# Altium schematic sheet main_sch.SchDoc
size C; SheetNumber: 2; SheetTotal: 2
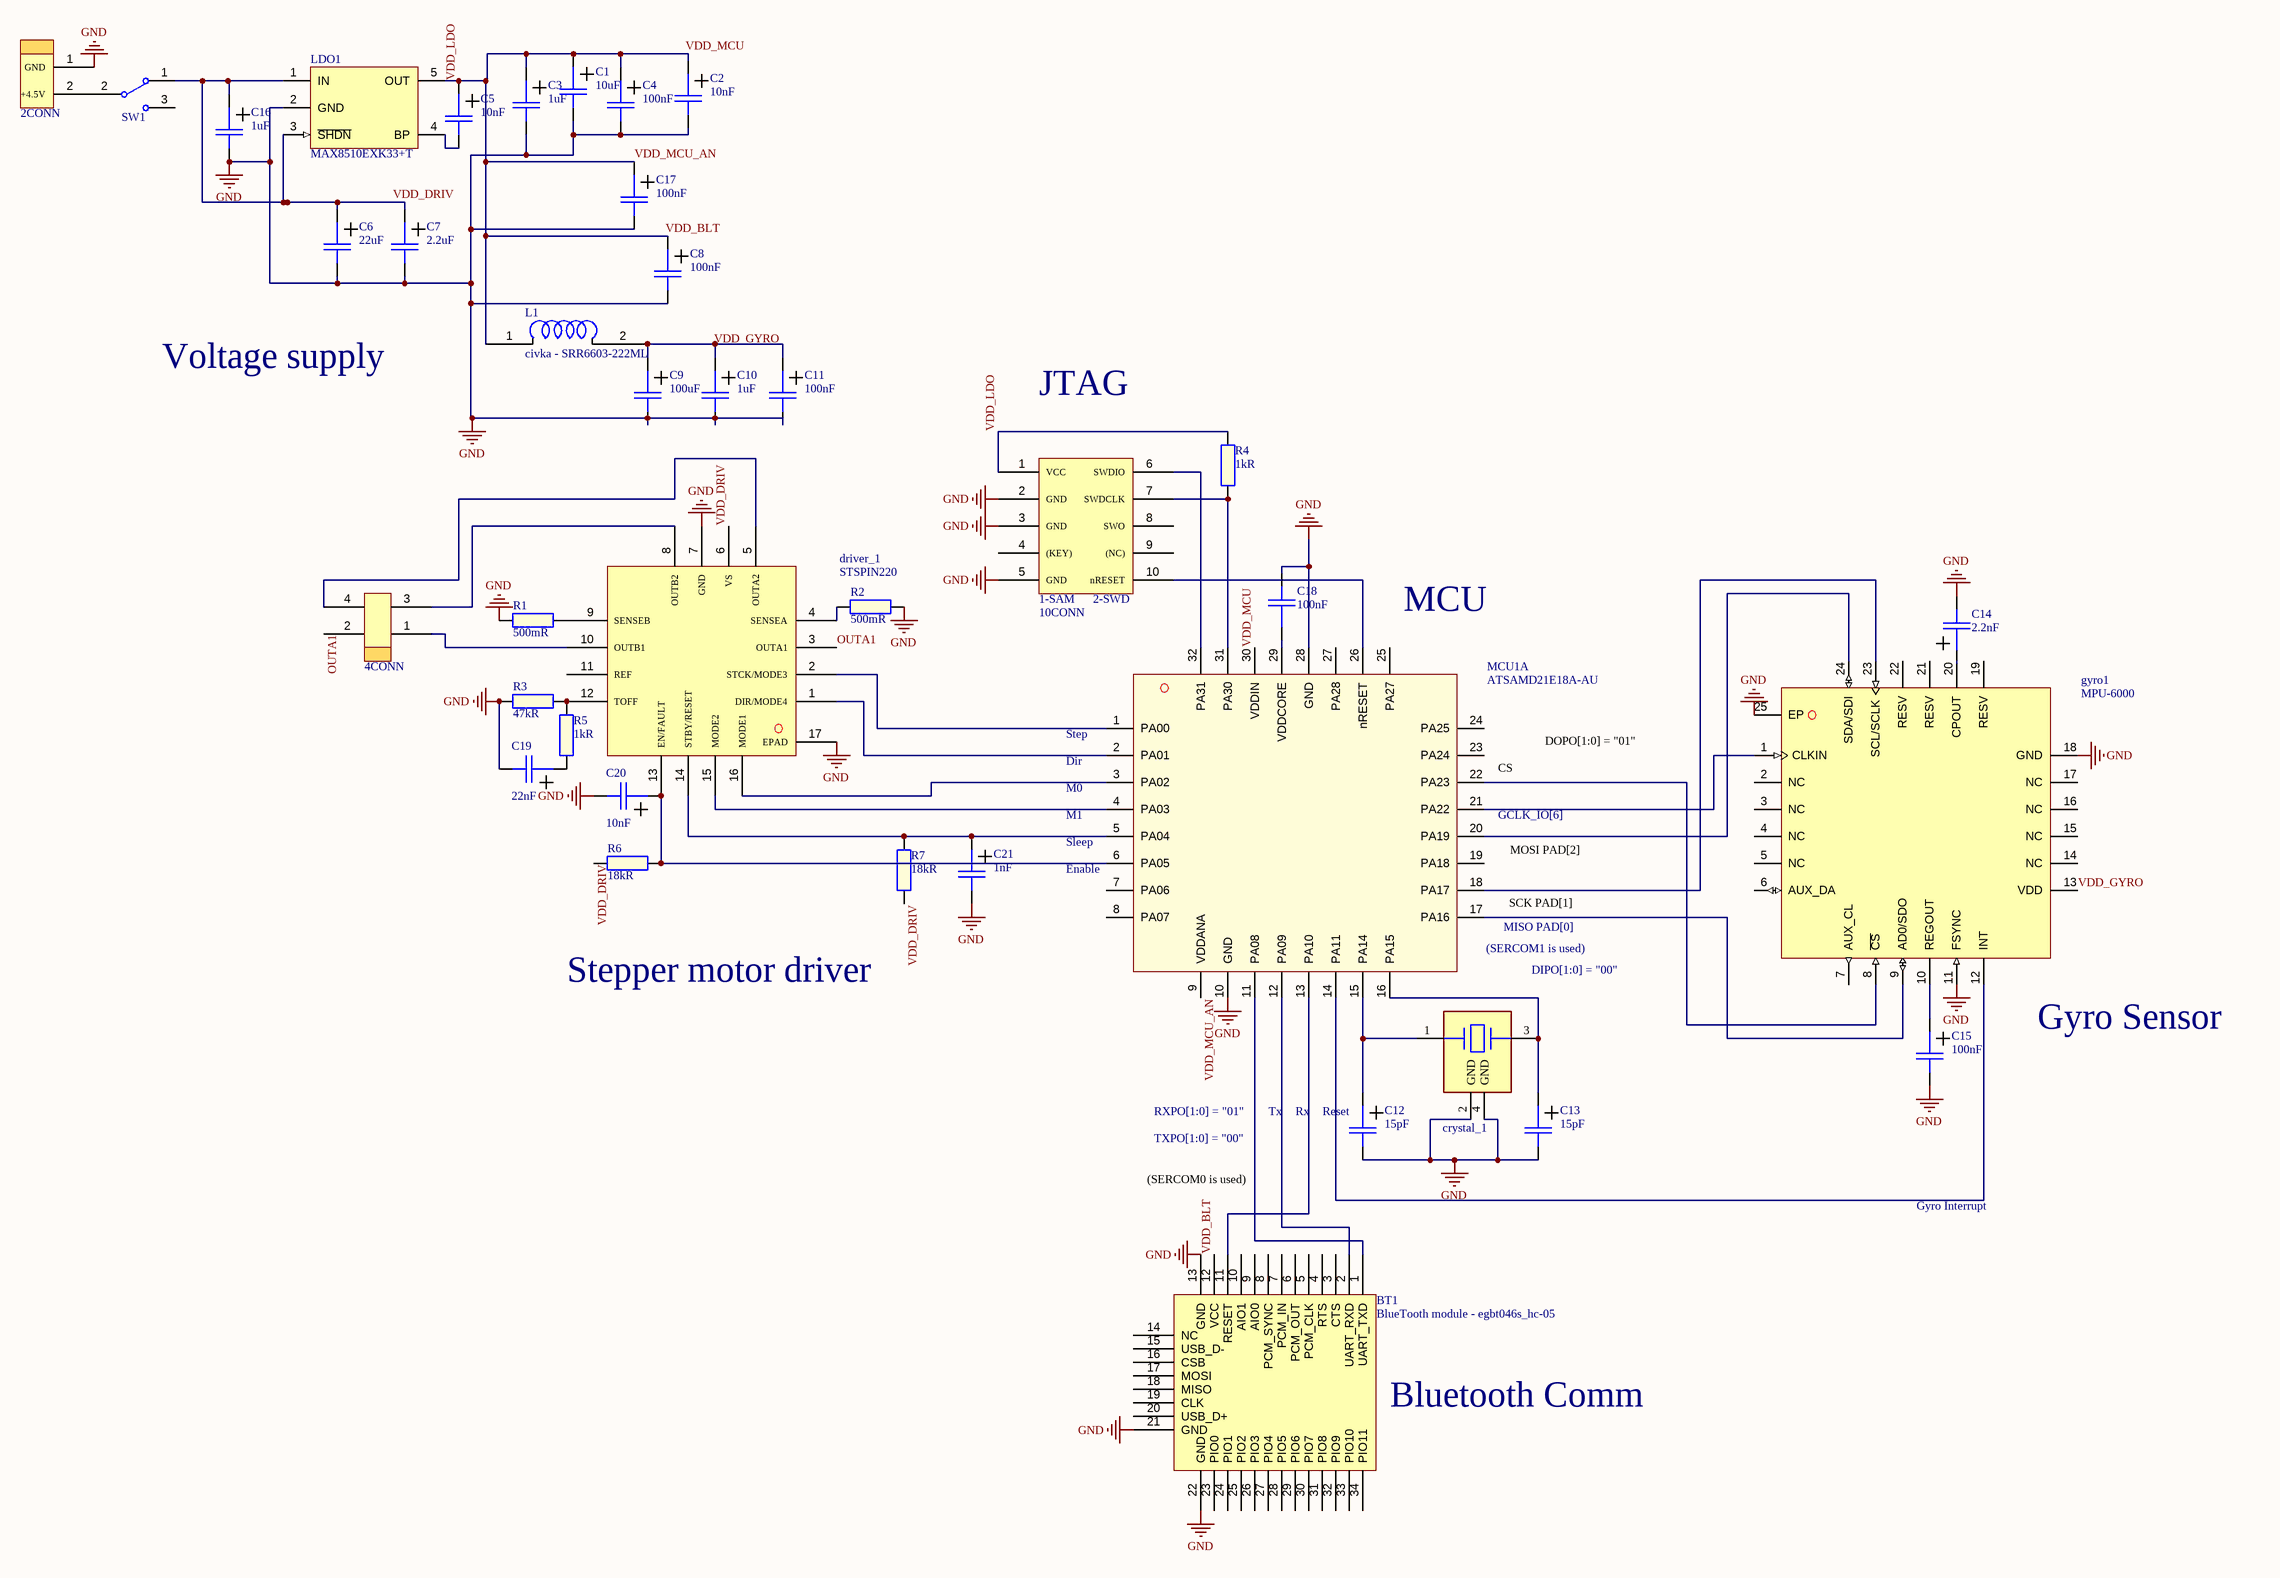
[diagram p0: main_sch.SchDoc]

## Parts
2CONN  39-30-1020  [39-30-1020]  (value not drawn)
4CONN  39-30-1040  [39-30-1040]  (value not drawn)
10CONN  konektor - GPEA214-0502A005C1BA  [konektor - GPEA214-0502A005C1BA]  (value not drawn)
BT1  BlueTooth module - egbt046s_hc-05  [BT_EGBT-046S]
C1  10uF  [0805 (2x1.2)]
C2  10nF  [0805 (2x1.2)]
C3  1uF  [0805 (2x1.2)]
C4  100nF  [0805 (2x1.2)]
C5  10nF  [0805 (2x1.2)]
C6  22uF  [0805 (2x1.2)]
C7  2.2uF  [0805 (2x1.2)]
C8  100nF  [0805 (2x1.2)]
C9  100uF  [0805 (2x1.2)]
C10  1uF  [0805 (2x1.2)]
C11  100nF  [0805 (2x1.2)]
C12  15pF  [0805 (2x1.2)]
C13  15pF  [0805 (2x1.2)]
C14  2.2nF  [0805 (2x1.2)]
C15  100nF  [0805 (2x1.2)]
C16  1uF  [0805 (2x1.2)]
C17  100nF  [0805 (2x1.2)]
C18  100nF  [0805 (2x1.2)]
C19  22nF  [0805 (2x1.2)]
C20  10nF  [0805 (2x1.2)]
C21  1nF  [0805 (2x1.2)]
crystal_1  ABM8G-25.000MHz-B4Y-T  [crystal 3.2x2.5]  (value not drawn)
driver_1  STSPIN220  [driver - STSPIN220]
gyro1  MPU-6000  [gyro - MPU 6000]
L1  civka - SRR6603-222ML  [L_SRR6603-222ML]
LDO1  MAX8510EXK33+T  [LDO - MAX8510EXK33+T (SC70)]
MCU1  ATSAMD21E18A-AU  [MCU- ATSAMD21E18A-AU]  (part A of 7)
R1  500mR  [0805 (2x1.2)]
R2  500mR  [0805 (2x1.2)]
R3  47kR  [0805 (2x1.2)]
R4  1kR  [0805 (2x1.2)]
R5  1kR  [0805 (2x1.2)]
R6  18kR  [0805 (2x1.2)]
R7  18kR  [0805 (2x1.2)]
SW1  EG1218  [vypinac - EG1218]  (value not drawn)

## Nets
GND: 2CONN.1(GND) 10CONN.2(GND) 10CONN.3(GND) 10CONN.5(GND) BT1.13(GND) BT1.21(GND) BT1.22(GND) C1.2 C2.2 C3.2 C4.2 C6.2 C7.2 C8.2 C9.2 C10.2 C11.2 C12.2 C13.2 C14.2 C15.2 C16.2 C17.2 C18.2 C19.2 C20.2 C21.2 crystal_1.2(GND) crystal_1.4(GND) driver_1.7(GND) driver_1.17(EPAD) gyro1.11(FSYNC) gyro1.18(GND) gyro1.25(EP) LDO1.2(GND) MCU1.10(GND) MCU1.28(GND) R1.1 R2.1 R3.2
OUTA1: 4CONN.2 driver_1.3(OUTA1)
VDD_BLT: 10CONN.1(VCC) BT1.12(VCC) C1.1 C2.1 C3.1 C4.1 C5.1 C8.1 C17.1 L1.1 LDO1.5(OUT) MCU1.9(VDDANA) MCU1.30(VDDIN) R4.2  [also labelled VDD_LDO, VDD_MCU, VDD_MCU_AN]
VDD_DRIV: C6.1 C7.1 C16.1 driver_1.6(VS) LDO1.1(IN) LDO1.3(~{SHDN}) R6.2 R7.1 SW1.1
VDD_GYRO: gyro1.13(VDD)
Net2CONN_2: 2CONN.2(+4.5V) SW1.2(COM)
Net4CONN_1: 4CONN.1 driver_1.10(OUTB1)
Net4CONN_3: 4CONN.3 driver_1.8(OUTB2)
Net4CONN_4: 4CONN.4 driver_1.5(OUTA2)
Net10CONN_6: 10CONN.6(SWDIO) MCU1.32(PA31)
Net10CONN_7: 10CONN.7(SWDCLK) MCU1.31(PA30) R4.1
Net10CONN_10: 10CONN.10(nRESET) MCU1.26(nRESET)
NetBT1_1: BT1.1(UART_TXD) MCU1.11(PA08)
NetBT1_2: BT1.2(UART_RXD) MCU1.12(PA09)
NetBT1_11: BT1.11(RESET) MCU1.13(PA10)
NetC5_2: C5.2 LDO1.4(BP)
NetC9_1: C9.1 C10.1 C11.1 L1.2
NetC12_1: C12.1 crystal_1.1 MCU1.15(PA14)
NetC13_1: C13.1 crystal_1.3 MCU1.16(PA15)
NetC14_1: C14.1 gyro1.20(CPOUT)
NetC15_1: C15.1 gyro1.10(REGOUT)
NetC18_1: C18.1 MCU1.29(VDDCORE)
NetC19_1: C19.1 R5.2
NetC20_1: C20.1 driver_1.13(EN/FAULT) MCU1.6(PA05) R6.1
NetC21_1: C21.1 driver_1.14(STBY/RESET) MCU1.5(PA04) R7.2
Netdriver_1_1: driver_1.1(DIR/MODE4) MCU1.2(PA01)
Netdriver_1_2: driver_1.2(STCK/MODE3) MCU1.1(PA00)
Netdriver_1_4: driver_1.4(SENSEA) R2.2
Netdriver_1_9: driver_1.9(SENSEB) R1.2
Netdriver_1_12: driver_1.12(TOFF) R3.1 R5.1
Netdriver_1_15: driver_1.15(MODE2) MCU1.4(PA03)
Netdriver_1_16: driver_1.16(MODE1) MCU1.3(PA02)
Netgyro1_1: gyro1.1(CLKIN) MCU1.21(PA22)
Netgyro1_8: gyro1.8(~{CS}) MCU1.22(PA23)
Netgyro1_9: gyro1.9(AD0/SDO) MCU1.17(PA16)
Netgyro1_12: gyro1.12(INT) MCU1.14(PA11)
Netgyro1_23: gyro1.23(SCL/SCLK) MCU1.18(PA17)
Netgyro1_24: gyro1.24(SDA/SDI) MCU1.20(PA19)

Not connected (* = marked no-connect by the designer): 10CONN 4((KEY)) 8(SWO) 9((NC)); BT1 3(CTS) 4(RTS) 5(PCM_CLK) 6(PCM_OUT) 7(PCM_IN) 8(PCM_SYNC) 9(AIO0) 10(AIO1) 14(NC) 15(USB_D-) 16(CSB) 17(MOSI) 18(MISO) 19(CLK) 20(USB_D+) 23(PIO0) 24(PIO1) 25(PIO2) 26(PIO3) 27(PIO4) 28(PIO5) 29(PIO6) 30(PIO7) 31(PIO8) 32(PIO9) 33(PIO10) 34(PIO11); driver_1 11(REF); gyro1 2(NC) 3(NC) 4(NC) 5(NC) 6(AUX_DA) 7(AUX_CL) 14(NC) 15(NC) 16(NC) 17(NC) 19(RESV) 21(RESV) 22(RESV); MCU1 7(PA06) 8(PA07) 19(PA18) 23(PA24) 24(PA25) 25(PA27) 27(PA28); SW1 3

## Notes on the sheet
- Voltage supply
- JTAG
- MCU
- (near MCU1) Dir
- (near MCU1) Step
- (near MCU1) CS
- DOPO[1:0] = "01"
- (near MCU1) Sleep
- M1
- M0
- (near MCU1) GCLK_IO[6]
- (near MCU1) Enable
- (near MCU1) SCK PAD[1]
- (near MCU1) MOSI PAD[2]
- Stepper motor driver
- (near MCU1) (SERCOM1 is used)
- (near MCU1) MISO PAD[0]
- DIPO[1:0] = "00"
- (near gyro1) Gyro Sensor
- RXPO[1:0] = "01"
- Tx
- Rx
- (near C12) Reset
- (SERCOM0 is used)
- TXPO[1:0] = "00"
- Gyro Interrupt
- (near BT1) Bluetooth Comm
- Labels drawn without touching a wire or pin: VDD_GYRO
- DWG. NO.
- REV.
- SHT.
- REVISION
- DESCRIPTION
- DATE
- APPROVED
- THIS DOCUMENT AND THE DATA DISCLOSED HEREIN OR HEREWITH IS THE PROPERTY OF ALTIUM LIMITED AND MAY BE FREELY DISTRIBUTED IN WHOLE. NO RIGHTS ARE RESERVED OR EXPRESS OR IMPLIED WARANTEE GIVEN.
- ENG:
- DSN:
- APPROVALS
- PROJECT
- DOCUMENT REVISION:
- DESIGN ITEM:
- CHK:
- BOM:
- REFERENCE DOCUMENTS
- PROJECT REVISION:
- TITLE
- FAB DWG:
- PCB DWG:
- ASSY DWG:
- SCALE:
- SIZE
- C
- CAGE CODE
- FILE NAME
- DWG NO.
- SHEET
- OF
- REV
- (in symbol konektor - GPEA214-0502A005C1BA) 1-SAM; 2-SWD

## Library data of the parts
2CONN = 39-30-1020: Connector Wire to Board Header 2 Position 4.2mm Solder Right Angle Thru-Hole Bag; Manufacturer: Molex; Number of Terminals/Pins: 2; Contact Resistance: 10mR; Gender: Male; Connector Type: Male Pin; Current Rating: 13A; Number of Ports: 1; Voltage Rating: 600V; Row Spacing: 0.165inch; Approvals: UL,CSA,TUV; Supplier 1: Digi-Key; Manufacturer Part Number: 39-30-1020; RoHS: Yes; Category: Headers and Wire Housings; Stock 1: 12451; Pricing 1: 1=0,66000, 10=0,55300, 100=0,43000, 1000=0,33784, 5000=0,29689, 10000=0,27641 (USD); Mount: Through Hole; Contact Material: Brass; Contact Plating: Tin,Copper; Housing Material: Nylon; Housing Color: Black; Color: Natural; Min Operating Temperature: -40°C; Max Operating Temperature: 105°C; Termination: Solder; Number of Rows: 2; Orientation: Right Angle; Number of Positions: 2; Fastening Type: Ramp; Packaging: Bulk; Number of Contacts: 2; Series: Mini-Fit® Jr™ 5569; Number of Circuits: 2; Package Quantity: 8000; Contact Gender: Male; Contact Type: Male Pin; Length: 5.4mm; Height: 14.76mm; Pitch: 4.2mm; Depth: 19.4mm; Radiation Hardening: No; RoHS Compliant: Yes; Flammability Rating: UL94 V-0; REACH SVHC: Unknown; ComponentLink1URL: https://datasheet.ciiva.com/6814/039301100-sd-6814020.pdf?src-supplier=Digi-Key; ComponentLink1Description: https://datasheet.ciiva.com/6814/039301100-sd-6814020.pdf?src-supplier=Digi-Key; ComponentLink2URL: https://datasheet.ciiva.com/11747/0900766b805f2c40-11747493.pdf?src-supplier=RSComponents; ComponentLink2Description: https://datasheet.ciiva.com/11747/0900766b805f2c40-11747493.pdf?src-supplier=RSComponents; ComponentLink3URL: https://datasheet.ciiva.com/30130/183450039301020-pcb-headers-30130157.pdf?src-supplier=Onlinecomponents.com; ComponentLink3Description: https://datasheet.ciiva.com/30130/183450039301020-pcb-headers-30130157.pdf?src-supplier=Onlinecomponents.com; Supplier 2: Farnell; Stock 2: 24772; Pricing 2: 1=0,48700, 10=0,41400, 50=0,36800, 100=0,32100, 500=0,30600, 1000=0,25200 (GBP)
4CONN = 39-30-1040: Connector Wire to Board Header 4 Position 4.2mm Solder Right Angle Thru-Hole Tray; Manufacturer: Molex; Current Rating: 13A; Number of Contacts: 4; Insulation Resistance: 1GR; Voltage Rating: 600V; Contact Resistance: 10mR; Mating Cycles: 30; Connector Type: Power,Rectangular; Gender: Male; Number of Ports: 1; Row Spacing: 0.165inch; Approvals: UL,CSA,TUV; Glow Wire Compliant: Non-compliant; Supplier 1: RSComponents; Manufacturer Part Number: 39-30-1040; RoHS: Yes; Category: Headers and Wire Housings; Stock 1: 3250; Pricing 1: 5=0,89800, 100=0,68900, 375=0,65200, 1500=0,49600, 3000=0,47100, 5=0,64400, 100=0,49400, 375=0,46800, 1500=0,35600, 3000=0,33800 (USD); Mount: Through Hole; Contact Material: Brass; Housing Material: Nylon; Contact Plating: Tin,Copper; Color: Natural; Material: Nylon; Housing Color: Natural; Min Operating Temperature: -40°C; Max Operating Temperature: 105°C; Termination: Solder; Orientation: Right Angle; Number of Poles: 4; Number of Rows: 2; Voltage Rating (AC): 600V; Package Quantity: 4000; Packaging: Bulk; Contact Gender: Male; Number of Positions: 4; Working Voltage: 600V; Number of Circuits: 4; Voltage Rating (DC): 600V; Fastening Type: Ramp; Series: Mini-Fit® Jr™ 5569; Contact Type: Male Pin; Length: 9.6mm; Height: 13.38mm; Pitch: 4.2mm; Depth: 19.4mm; Radiation Hardening: No; RoHS Compliant: Yes; REACH SVHC: No SVHC; ELV: Compliant; Halogen Free: Low Halogen; Lead Free: Lead Free; Flammability Rating: UL94 V-0; ComponentLink1URL: https://datasheet.ciiva.com/3935/240160039301040-pcb-headers-3935946.pdf?src-supplier=Arrow+Electronics; ComponentLink1Description: https://datasheet.ciiva.com/3935/240160039301040-pcb-headers-3935946.pdf?src-supplier=Arrow+Electronics; ComponentLink2URL: https://datasheet.ciiva.com/26921/getdatasheetpartid-176629-26921992.pdf?src-supplier=Verical; ComponentLink2Description: https://datasheet.ciiva.com/26921/getdatasheetpartid-176629-26921992.pdf?src-supplier=Verical; ComponentLink3URL: https://datasheet.ciiva.com/19461/1969163-19461149.pdf?src-supplier=Jameco; ComponentLink3Description: https://datasheet.ciiva.com/19461/1969163-19461149.pdf?src-supplier=Jameco; ComponentLink4URL: https://datasheet.ciiva.com/11748/0900766b805f2c40-11748053.pdf?src-supplier=RSComponents; ComponentLink4Description: https://datasheet.ciiva.com/11748/0900766b805f2c40-11748053.pdf?src-supplier=RSComponents; ComponentLink5URL: https://datasheet.ciiva.com/5162/0039301040-pcb-headers-160097-5162586.pdf?src-supplier=Mouser; ComponentLink5Description: https://datasheet.ciiva.com/5162/0039301040-pcb-headers-160097-5162586.pdf?src-supplier=Mouser; ComponentLink6URL: https://datasheet.ciiva.com/18454/70190747-18454021.pdf?src-supplier=Allied+Electronics; ComponentLink6Description: https://datasheet.ciiva.com/18454/70190747-18454021.pdf?src-supplier=Allied+Electronics; Supplier 2: Farnell; Stock 2: 793; Pricing 2: 1=0,64500, 10=0,52900, 50=0,52800, 100=0,52700, 500=0,50700, 1000=0,49600 (GBP)
10CONN = konektor - GPEA214-0502A005C1BA: Connector, Header, 10POS, 2ROW, 1.27MM; Manufacturer: Greenconn; Supplier 1: Newark; Manufacturer Part Number: GPEA214-0502A005C1BA; RoHS: No; Stock 1: 230; Pricing 1: 1=0,02800, 250=0,02800, 500=0,02800, 1000=0,02800, 5000=0,02800 (USD); Supplier 2: Farnell; Stock 2: 8410; Pricing 2: 10=0,23100, 100=0,17100, 500=0,15400, 1000=0,13600, 2500=0,12800, 5000=0,12500 (GBP)
C1 = C0805 (2x1.2): Capacitance: 10uF; ComponentLink1URL: http://www.mouser.com/ds/2/40/f93-776559.pdf?src-supplier=Mouser; ComponentLink1Description: http://www.mouser.com/ds/2/40/f93-776559.pdf?src-supplier=Mouser; ComponentLink2URL: http://www.farnell.com/datasheets/2602419.pdf?src-supplier=Farnell; ComponentLink2Description: http://www.farnell.com/datasheets/2602419.pdf?src-supplier=Farnell; ComponentLink3URL: http://datasheets.avx.com/F93.pdf?src-supplier=Digi-Key; ComponentLink3Description: http://datasheets.avx.com/F93.pdf?src-supplier=Digi-Key; ComponentLink4URL: http://www.farnell.com/datasheets/2602419.pdf?src-supplier=Newark; ComponentLink4Description: http://www.farnell.com/datasheets/2602419.pdf?src-supplier=Newark; Case/Package: 0805
C2-C21 = C0805 (2x1.2): Capacitance: 10uF; ComponentLink1URL: http://www.mouser.com/ds/2/40/f93-776559.pdf?src-supplier=Mouser; ComponentLink1Description: http://www.mouser.com/ds/2/40/f93-776559.pdf?src-supplier=Mouser; ComponentLink2URL: http://www.farnell.com/datasheets/2602419.pdf?src-supplier=Farnell; ComponentLink2Description: http://www.farnell.com/datasheets/2602419.pdf?src-supplier=Farnell; ComponentLink3URL: http://datasheets.avx.com/F93.pdf?src-supplier=Digi-Key; ComponentLink3Description: http://datasheets.avx.com/F93.pdf?src-supplier=Digi-Key; ComponentLink4URL: http://www.farnell.com/datasheets/2602419.pdf?src-supplier=Newark; ComponentLink4Description: http://www.farnell.com/datasheets/2602419.pdf?src-supplier=Newark; Case/Package: 0805
crystal_1 = crystal 3.2x2.5: CRYSTAL 25.0000MHZ 10PF SMD; Frequency Tolerance: 30ppm; Series Resistance: 60R; Frequency: 25MHz; Operating Frequency: 25 MHz; Termination: SMD/SMT; Load Capacitance: 10pF; Width: 0.098inch; Height: 0.039inch; Min Operating Temperature: -20°C; Frequency Stability: 30ppm; Series: ABM8G; Packaging: Tape and Reel; Depth: 2.5mm; Package Quantity: 1000; Case/Package: SMD/SMT; Tolerance: 30ppm; ESR (Equivalent Series Resistance): 60R; Number of Pins: 4; Length: 3.2mm; Mount: Surface Mount; Lead Free: Lead Free; Max Operating Temperature: 70°C
driver_1 = driver - STSPIN220: STSPIN220 Series 10 V Quad Surface Mount Stepper Motor Driver - VFQFPN-16; Manufacturer: STMicroelectronics; Logic Function: AND GATE; Output Current: 1.3A; Supplier 1: Digi-Key; Manufacturer Part Number: STSPIN220; RoHS: Yes; Category: MOSFETs; Stock 1: 1040; Pricing 1: 1=1,89000, 10=1,69900, 25=1,60320, 100=1,36600, 250=1,28260, 500=1,12228, 1000=1,05875 (USD); Mount: Surface Mount; Min Operating Temperature: -40°C; Max Operating Temperature: 150°C; Packaging: Cut Tape; RoHS Compliant: Yes; ComponentLink1URL: http://www.farnell.com/datasheets/2815804.pdf?src-supplier=Farnell; ComponentLink1Description: http://www.farnell.com/datasheets/2815804.pdf?src-supplier=Farnell; ComponentLink2URL: http://www.st.com/content/ccc/resource/technical/document/datasheet/group3/42/7e/5c/90/70/ef/47/95/DM00291865/files/DM00291865.pdf/jcr:content/translations/en.DM00291865.pdf?src-supplier=Digi-Key; ComponentLink2Description: http://www.st.com/content/ccc/resource/technical/document/datasheet/group3/42/7e/5c/90/70/ef/47/95/DM00291865/files/DM00291865.pdf/jcr:content/translations/en.DM00291865.pdf?src-supplier=Digi-Key; ComponentLink3URL: http://www.farnell.com/datasheets/2815804.pdf?src-supplier=Newark; ComponentLink3Description: http://www.farnell.com/datasheets/2815804.pdf?src-supplier=Newark; Supplier 2: Farnell; Stock 2: 3459; Pricing 2: 1=2,38000, 10=1,73000, 50=1,66000, 100=1,58000 (GBP)
gyro1 = gyro - MPU 6000: 3-Axis Gyroscope 3-Axis Accelerometer Motion Processing Unit with I2C and SPI, 2.5, 3 or 3.3 V, -40 to 85 degC, 24-Pin QFN, RoHS, Tape and Reel; Manufacturer: InvenSense; Featured Product: MPU60006AxisIntegratedSPISolution; Output Type: I²C,SPI; Sensor Type: Accelerometer,Gyroscope,3Axis; Other Names: 1428-1005-2 / MPU6000; Online Catalog: MPU-6000™Series; Operating Temperature: -40degC~85degC(TA); Datasheet URL: https://www.invensense.com/wp-content/uploads/2015/02/MPU-6000-Datasheet1.pdf; Manufacturer URL: http://www.invensense.com/; Datasheet Version: Rev. 3.4, 08/2013; Standard Package: 5,000; Family: Multifunction; Package Reference: QFN-24; Category: Sensors,Transducers; Package Description: 24-Pin Quad Flat No-lead Package, Body 4 x 4 mm, Pitch 0.5 mm
L1 = civka - SRR6603-222ML: Inductor Power Shielded Wirewound 2200uH 20% 100KHz 50Q-Factor Ferrite 0.1A 8.5Ohm DCR T/R; Manufacturer: Bourns; Inductance: 2.2mH; DC Resistance (DCR): 8.5R; Max DC Current: 100mA; Saturation Current: 28mA; Q Factor: 50; Self Resonant Frequency: 2MHz; Supplier 1: Digi-Key; Manufacturer Part Number: SRR6603-222ML; RoHS: Yes; Category: Fixed Inductors; Stock 1: 631; Pricing 1: 1=1,49000, 10=1,38400, 25=1,27760, 50=1,06460, 100=1,00070, 250=0,89420 (USD); Mount: Surface Mount; Case/Package: Nonstandard; Number of Pins: 2; Core Material: Ferrite; Min Operating Temperature: -55°C; Max Operating Temperature: 125°C; Tolerance: 20%; Resistor Type: Wirewound; Test Frequency: 100kHz; Termination: SMD/SMT; RMS Current (Irms): 100mA; DC Current: 100mA; Packaging: Tape and Reel; Inductance Tolerance: 20%; Package Quantity: 600; Current Rating: 100mA; Shielding: Shielded; Length: 6.6mm; Width: 0.173inch; Height: 3mm; Depth: 4.4mm; Height - Seated (Max): 0.118inch; Radiation Hardening: No; REACH SVHC: No SVHC; Military Standard: Not; ComponentLink1URL: https://datasheet.ciiva.com/22717/1727926-22717872.pdf?src-supplier=Element14; ComponentLink1Description: https://datasheet.ciiva.com/22717/1727926-22717872.pdf?src-supplier=Element14; ComponentLink2URL: https://datasheet.ciiva.com/17285/srr6603-17285749.pdf?src-supplier=Avnet+Europe; ComponentLink2Description: https://datasheet.ciiva.com/17285/srr6603-17285749.pdf?src-supplier=Avnet+Europe; ComponentLink3URL: https://datasheet.ciiva.com/1073/srr6603-1073449.pdf?src-supplier=Digi-Key; ComponentLink3Description: https://datasheet.ciiva.com/1073/srr6603-1073449.pdf?src-supplier=Digi-Key; ComponentLink4URL: https://datasheet.ciiva.com/1073/srr6603-1073450.pdf?src-supplier=Digi-Key; ComponentLink4Description: https://datasheet.ciiva.com/1073/srr6603-1073450.pdf?src-supplier=Digi-Key
LDO1 = LDO - MAX8510EXK33+T: Ultra-Low-Noise, High PSRR, Low-Dropout, 120mA Linear Regulator, 3.3V Out, 5-Pin SC70, -40°C to +85°C, Pb-Free, Tape and Reel; PackageVersion: revE, 2006; PackageReference: X5+1; ComponentLink3Description: Package Specification; ComponentLink2Description: Datasheet; PackageDescription: 5-Pin SC70 Transistor Package, 0.65 mm Pitch, 2.2 mm Lead Span; ComponentLink1URL: http://www.maxim-ic.com; Code_JEDEC: MO-203; ComponentLink3URL: http://pdfserv.maxim-ic.com/package_dwgs/21-0076.PDF; ComponentLink2URL: http://datasheets.maxim-ic.com/en/ds/MAX8510-MAX8512.pdf; DatasheetVersion: Rev 4, Aug-2011; ComponentLink1Description: Manufacturer URL
MCU1 = MCU - ATSAMD21E18A-AU: Low-Power, 32-bit Cortex-M0+ MCU with advanced Analog and PWM
R1-R7 = R0805: Resistor 470R, 1206, 1%
SW1 = vypinac - EG1218: Slide Switch, 500 V, -20 to 70 degC, 3-Pin THD, RoHS; Case\Package: SOT-23-5; Output Current: 150 mA; Nominal Output Voltage: 3.3 V; Max Power Dissipation: 250 mW; Min Input Voltage: 4.3 V; Outputs: 1; Max Input Voltage: 8 V; Dropout Voltage: 300 mV; PackageDescription: 3-Pin Through Hole Device, Body 11.6 x 4 mm, Pitch 2.5 mm; ComponentLink1URL: http://www.e-switch.ch/en/; RoHSCompliant: true; Length: 3 mm; ComponentLink1Description: Manufacturer URL; Power Rating: 250 mW; Mount: Surface Mount; Max Operating Temperature: 85 degC; REACH SVHC: No SVHC; Radiation Hardening: No; Height: 1.3 mm; Pins: 5; Max Ouput Current: 150 mA; Output Voltage: 3.3 V; Width: 1.8 mm; Package Quantity: 3000; ComponentLink2URL: https://www.e-switch.com/system/asset/product_line/data_sheet/119/EG.pdf; Min Operating Temperature: -40 degC; ComponentLink2Description: Datasheet; DatasheetVersion: Oct-15; PackageReference: EG1218; Packaging: Tape and Reel